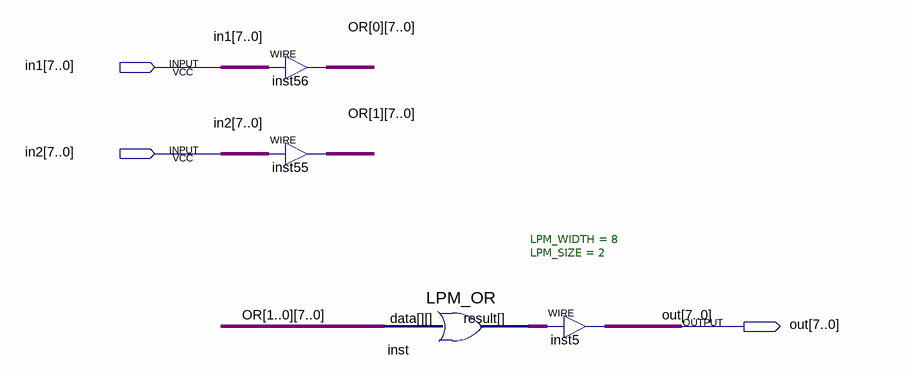
[diagram p0: schematic sheet]
// Quartus schematic orb8.bdf as structural Verilog: 4 symbols, 3 pins
module orb8 (
  input  [7:0] in1,
  input  [7:0] in2,
  output [7:0] out
);

  wire [7:0] inst_result, OR_0, OR_1;

  assign OR_0 = in1;  // WIRE inst56
  assign OR_1 = in2;  // WIRE inst55
  LPM_OR #(.LPM_WIDTH(8), .LPM_SIZE(2)) inst (.data({OR_1, OR_0}), .result(inst_result));
  assign out = inst_result;  // WIRE inst5
endmodule
